# EAGLE schematic amplifier2 (EAGLE 9.3.0)
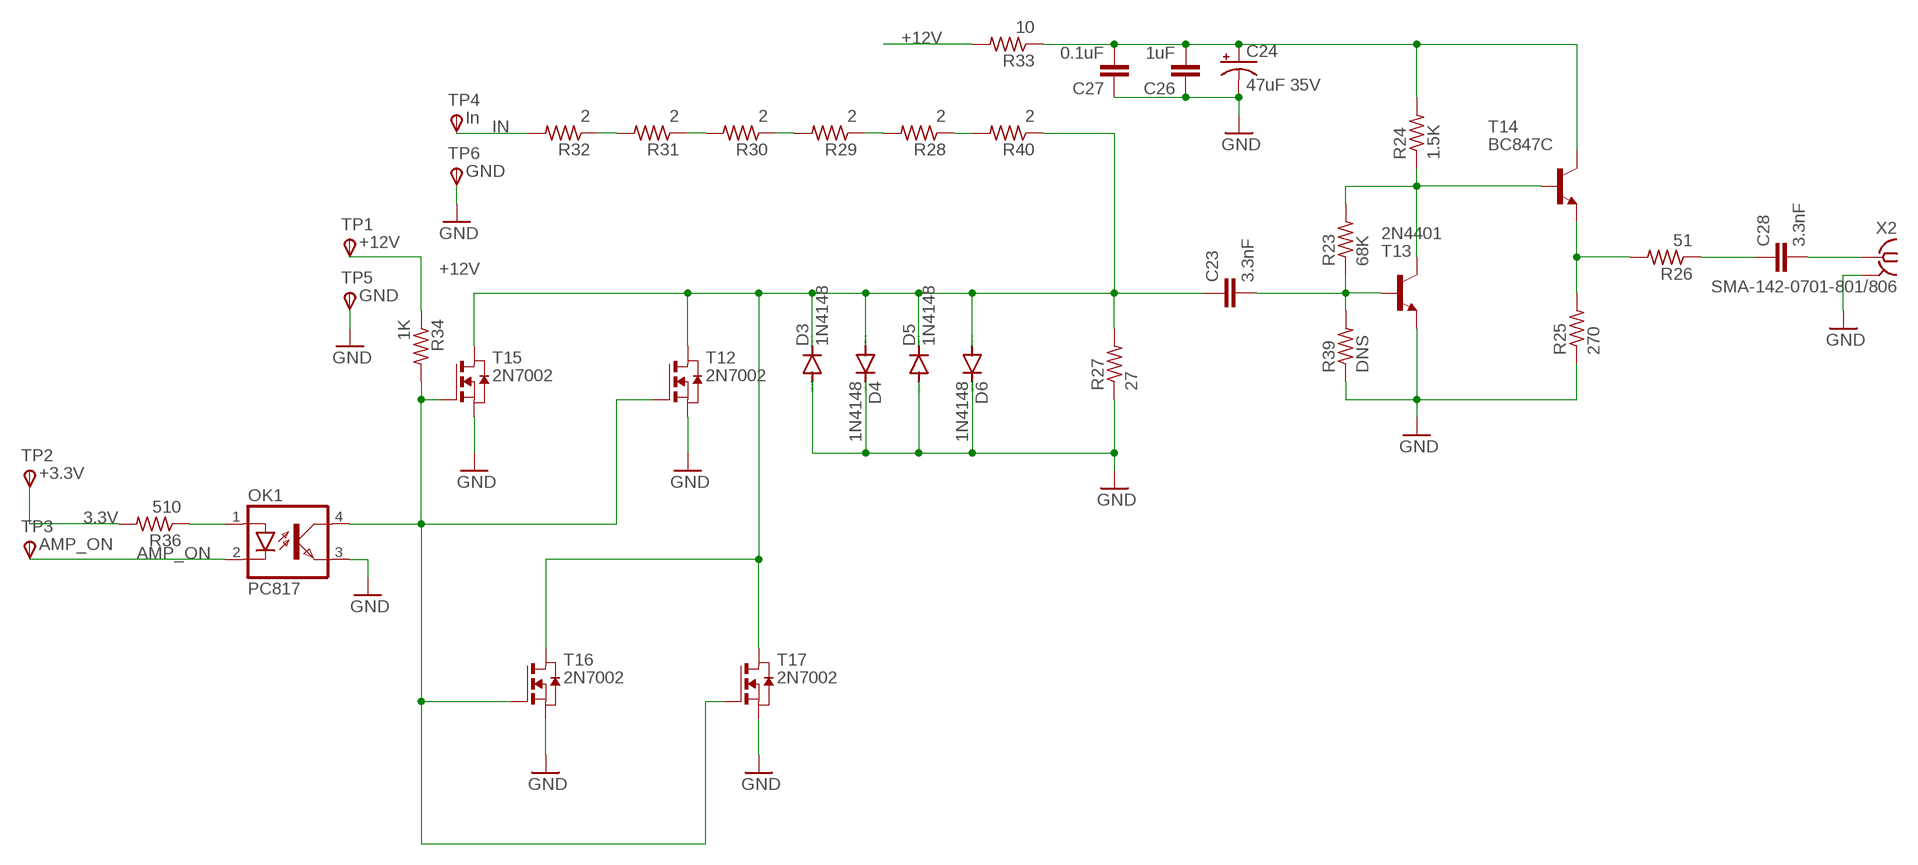
[diagram p0: schematic, sheet 1]

## Parts
C23  3.3nF  C-EUC0805  [C0805]
C24  47uF 35V  CPOL-US153CLV-1010  [153CLV-1010]
C26  1uF  C-EUC0805  [C0805]
C27  0.1uF  C-EUC0805  [C0805]
C28  3.3nF  C-EUC0805  [C0805]
D3  1N4148  DIODE-MINIMELF  [MINIMELF]
D4  1N4148  DIODE-MINIMELF  [MINIMELF]
D5  1N4148  DIODE-MINIMELF  [MINIMELF]
D6  1N4148  DIODE-MINIMELF  [MINIMELF]
OK1  PC817  [DIL04]
R23  68K  R-US_R1206W  [R1206W]
R24  1.5K  R-US_R1206W  [R1206W]
R25  270  R-US_R1206W  [R1206W]
R26  51  R-US_R1206W  [R1206W]
R27  27  R-US_R1206W  [R1206W]
R28  2  R-US_R1206W  [R1206W]
R29  2  R-US_R1206W  [R1206W]
R30  2  R-US_R1206W  [R1206W]
R31  2  R-US_R1206W  [R1206W]
R32  2  R-US_R1206W  [R1206W]
R33  10  R-US_R1206W  [R1206W]
R34  1K  R-US_R1206W  [R1206W]
R36  510  R-US_R1206W  [R1206W]
R39  DNS  R-US_R1206W  [R1206W]
R40  2  R-US_R1206W  [R1206W]
T12  2N7002  NMOSSOT23  [SOT-23]
T13  2N4401  2N4401-NPN-TO92-EBC  [TO92-EBC]
T14  BC847C  BC847C-NPN-SOT23-BEC  [SOT23-BEC]
T15  2N7002  NMOSSOT23  [SOT-23]
T16  2N7002  NMOSSOT23  [SOT-23]
T17  2N7002  NMOSSOT23  [SOT-23]
TP1  TPSB2,54  [B2,54]
TP2  TPSB2,54  [B2,54]
TP3  TPSB2,54  [B2,54]
TP4  TPSB2,54  [B2,54]
TP5  TPSB2,54  [B2,54]
TP6  TPSB2,54  [B2,54]
X2  SMA-142-0701-801/806  [J502-ND-142-0701-801/806]

## Nets
3.3V [power]: R36.2 TP2.TP(PP)
+12V [power]: R33.2 R34.1 TP1.TP(PP)
AMP_ON: OK1.2(C) TP3.TP(PP)
GND: C24.- C26.1 C27.1 D3.A D4.C D5.A D6.C OK1.3(EMIT) R25.1 R27.1 R39.1 T12.2(S) T13.E T15.2(S) T16.2(S) T17.2(S) TP5.TP(PP) TP6.TP(PP) X2.G@1 X2.G@2 X2.G@3 X2.G@4
IN: R32.2 TP4.TP(PP)
N$17: C23.2 R23.1 R39.2 T13.B
N$18: R23.2 R24.1 T13.C T14.B
N$20: OK1.1(A) R36.1
N$21: OK1.4(COL) R34.2 T12.3(G) T15.3(G) T16.3(G) T17.3(G)
N$22: R25.2 R26.2 T14.E
N$30: R28.2 R29.1
N$31: R29.2 R30.1
N$32: R30.2 R31.1
N$33: R31.2 R32.1
N$35: C24.+ C26.2 C27.2 R24.2 R33.1 T14.C
N$36: C28.1 R26.1
N$37: C23.1 D3.C D4.A D5.C D6.A R27.2 R40.1 T12.1(D) T15.1(D) T16.1(D) T17.1(D)
N$38: C28.2 X2.1
N$39: R28.1 R40.2

## Library data of the parts
C23 C26-C28 = resistor:C-EU: CAPACITOR, European symbol
C24 = rcl:CPOL-US: POLARIZED CAPACITOR, American symbol; SPICEPREFIX: C
D3-D6 = diode:DIODE-: DIODE
OK1 = optocoupler:PC817: SHARP OPTO COUPLER; MPN: PC817X4J000F; OC_FARNELL: 9707727; OC_NEWARK: 97K7059
R23-R34 R36 R39 R40 = resistor:R-US_: RESISTOR, American symbol
T12 T15-T17 = zetex:NMOSSOT23: MOS FET; OC_FARNELL: unknown; OC_NEWARK: unknown
T13 = transistor-neu-to92:*-NPN-: NPN Transistror BF959 corrected 2008.03.06
T14 = transistor:*-NPN-: NPN Transistror BF959 corrected 2008.03.06
TP1 = testpad:TPS: TEST PIN; TP_SIGNAL_NAME: +12V
TP2 = testpad:TPS: TEST PIN; TP_SIGNAL_NAME: +3.3V
TP3 = testpad:TPS: TEST PIN; TP_SIGNAL_NAME: AMP_ON
TP4 = testpad:TPS: TEST PIN; TP_SIGNAL_NAME: In
TP5 TP6 = testpad:TPS: TEST PIN; TP_SIGNAL_NAME: GND
X2 = con-coax:SMA-: SMA 50 Ohm End Launch Jack Receptacle - Round Contact Johnson Components Source: www.johnsoncomponents.com .. J502-ND.pdf; MF: JOHNSON COMPONENTS; MPN: 142-0701-801; OC_FARNELL: 1608592; OC_NEWARK: 90F2624

## Net classes
0 default: width 0.3 mm, drill 0.3 mm, clearance 0.508 mm
1 power: width 0.61 mm, drill 0.5 mm, clearance 0.508 mm to class 0, clearance 0.508 mm